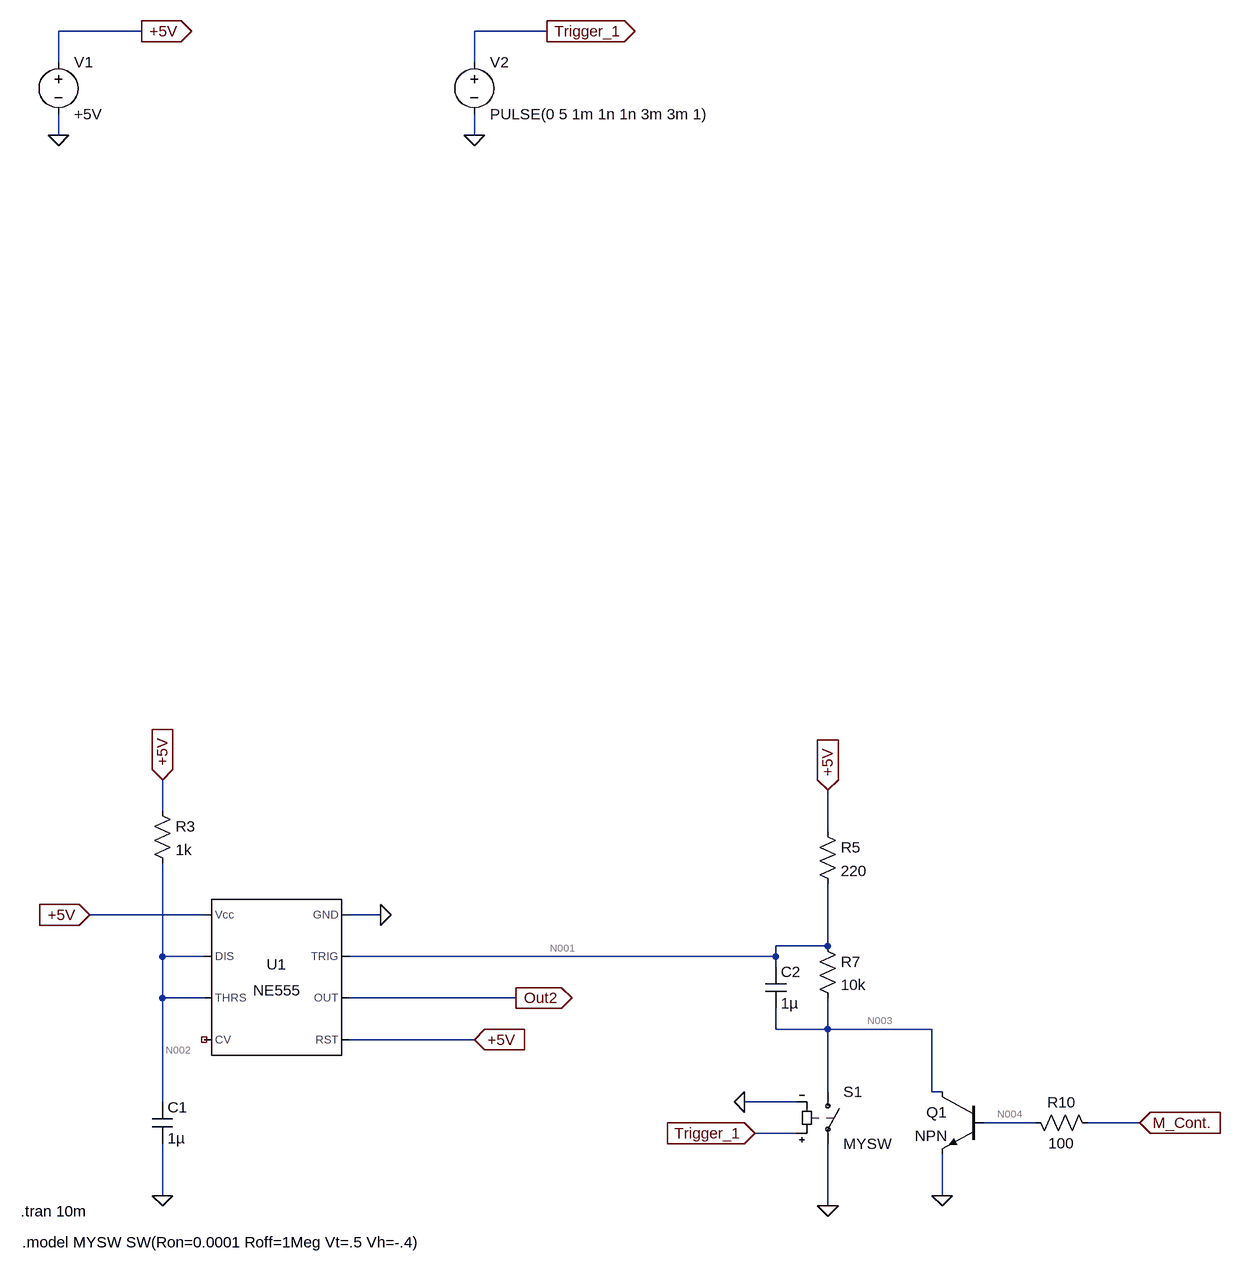
[diagram p0: schematic MONO_KIP.asc]
MONO_KIP.asc, the LTspice schematic file:
Version 4
SHEET 1 1516 1384
WIRE -176 -496 -304 -496
WIRE 448 -496 336 -496
WIRE -304 -448 -304 -496
WIRE 336 -448 336 -496
WIRE -304 -336 -304 -368
WIRE 336 -336 336 -368
WIRE -144 704 -144 656
WIRE 880 736 880 672
WIRE -80 864 -256 864
WIRE 192 864 144 864
WIRE 880 912 880 816
WIRE 880 912 800 912
WIRE -144 928 -144 784
WIRE -80 928 -144 928
WIRE 800 928 800 912
WIRE 800 928 144 928
WIRE 800 944 800 928
WIRE -144 992 -144 928
WIRE -80 992 -144 992
WIRE 400 992 144 992
WIRE 800 1040 800 1008
WIRE 880 1040 880 992
WIRE 880 1040 800 1040
WIRE 1040 1040 880 1040
WIRE 336 1056 144 1056
WIRE 880 1136 880 1040
WIRE 1040 1136 1040 1040
WIRE 1056 1136 1040 1136
WIRE -144 1152 -144 992
WIRE 832 1152 752 1152
WIRE 1200 1184 1120 1184
WIRE 1360 1184 1280 1184
WIRE 832 1200 768 1200
WIRE -144 1296 -144 1216
WIRE 1056 1296 1056 1232
WIRE 880 1312 880 1216
FLAG -176 -496 +5V
IOPIN -176 -496 Out
FLAG -304 -336 0
FLAG 448 -496 Trigger_1
IOPIN 448 -496 Out
FLAG 336 -336 0
FLAG -256 864 +5V
IOPIN -256 864 In
FLAG 336 1056 +5V
IOPIN 336 1056 In
FLAG 192 864 0
FLAG 400 992 Out2
IOPIN 400 992 Out
FLAG -144 1296 0
FLAG -144 656 +5V
IOPIN -144 656 In
FLAG 752 1152 0
FLAG 768 1200 Trigger_1
IOPIN 768 1200 In
FLAG 880 1312 0
FLAG 1056 1296 0
FLAG 880 672 +5V
IOPIN 880 672 In
FLAG 1360 1184 M_Cont.
IOPIN 1360 1184 In
SYMBOL voltage -304 -464 R0
WINDOW 123 0 0 Left 0
WINDOW 39 0 0 Left 0
SYMATTR InstName V1
SYMATTR Value +5V
SYMBOL voltage 336 -464 R0
WINDOW 123 0 0 Left 0
WINDOW 39 0 0 Left 0
SYMATTR InstName V2
SYMATTR Value PULSE(0 5 1m 1n 1n 3m 3m 1)
SYMBOL Misc\\NE555 32 960 M0
SYMATTR InstName U1
SYMBOL cap -160 1152 R0
SYMATTR InstName C1
SYMATTR Value 1µ
SYMBOL res -160 688 R0
SYMATTR InstName R3
SYMATTR Value 1k
SYMBOL res 864 720 R0
SYMATTR InstName R5
SYMATTR Value 220
SYMBOL res 864 896 R0
SYMATTR InstName R7
SYMATTR Value 10k
SYMBOL cap 784 944 R0
SYMATTR InstName C2
SYMATTR Value 1µ
SYMBOL sw 880 1120 R0
SYMATTR InstName S1
SYMATTR Value MYSW
SYMBOL npn 1120 1136 M0
SYMATTR InstName Q1
SYMBOL res 1184 1168 M90
WINDOW 0 0 56 VBottom 2
WINDOW 3 32 56 VTop 2
SYMATTR InstName R10
SYMATTR Value 100
TEXT -362 1320 Left 2 !.tran 10m
TEXT -360 1368 Left 2 !.model MYSW SW(Ron=0.0001 Roff=1Meg Vt=.5 Vh=-.4)

The netlist it stands for:
* MONO_KIP.asc
V1 +5V 0 +5V
V2 Trigger_1 0 PULSE(0 5 1m 1n 1n 3m 3m 1)
XU1 0 N001 Out2 +5V NC_01 N002 N002 +5V NE555  ; pins GND TRIG OUT RST CV THRS DIS Vcc
C1 N002 0 1µ
R3 +5V N002 1k
R5 +5V N001 220
R7 N001 N003 10k
C2 N001 N003 1µ
S1 N003 0 Trigger_1 0 MYSW
Q1 N003 N004 0 0 NPN
R10 N004 M_Cont. 100
.model NPN NPN
.model PNP PNP
.lib standard.bjt
.tran 10m
.model MYSW SW(Ron=0.0001 Roff=1Meg Vt=.5 Vh=-.4)
.lib NE555.sub
.backanno
.end

* Results of the author's LTspice run, read from the files saved beside the schematic
* Operating Point, zero values left out:
*   V(+5v) = 5 V
*   V(n001) = 4.999 V
*   V(n002) = 5 V
*   V(out2) = 5 V
*   V(n003) = 4.949 V
*   V(n004) = 394.2 mV
*   V(m_cont.) = 394.2 mV
*   Ic(Q1) = 420.7 pA
*   Ie(Q1) = -420.7 pA
*   I(R3) = 11.67 nA
*   I(R5) = 4.955 µA
*   I(R7) = 4.95 µA
*   I(S1) = -4.949 µA
*   I(V1) = -1.616 mA
*   Ix(u1:1) = -1.611 mA
*   Ix(u1:2) = 4.999 nA
*   Ix(u1:4) = 22.67 µA
*   Ix(u1:6) = 5 nA
*   Ix(u1:7) = 6.672 nA
*   Ix(u1:8) = 1.588 mA
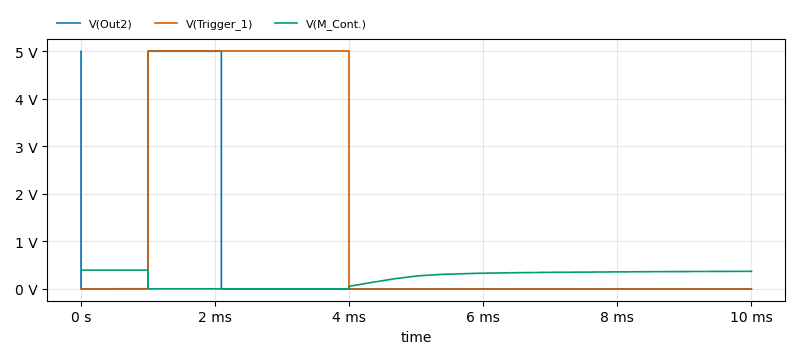
[diagram p1: Transient Analysis of MONO_KIP.asc, plotted from the saved traces]
* Transient Analysis, 1 run:
*   V(Out2): min 30 µV, max 5 V, average 546.7 mV, rms 1.653 V, last 30 µV
*   V(Trigger_1): min 0 V, max 5 V, average 1.5 V, rms 2.739 V, last 0 V
*   V(M_Cont.): min 0 V, max 394.2 mV, average 228.6 mV, rms 280.3 mV, last 369 mV